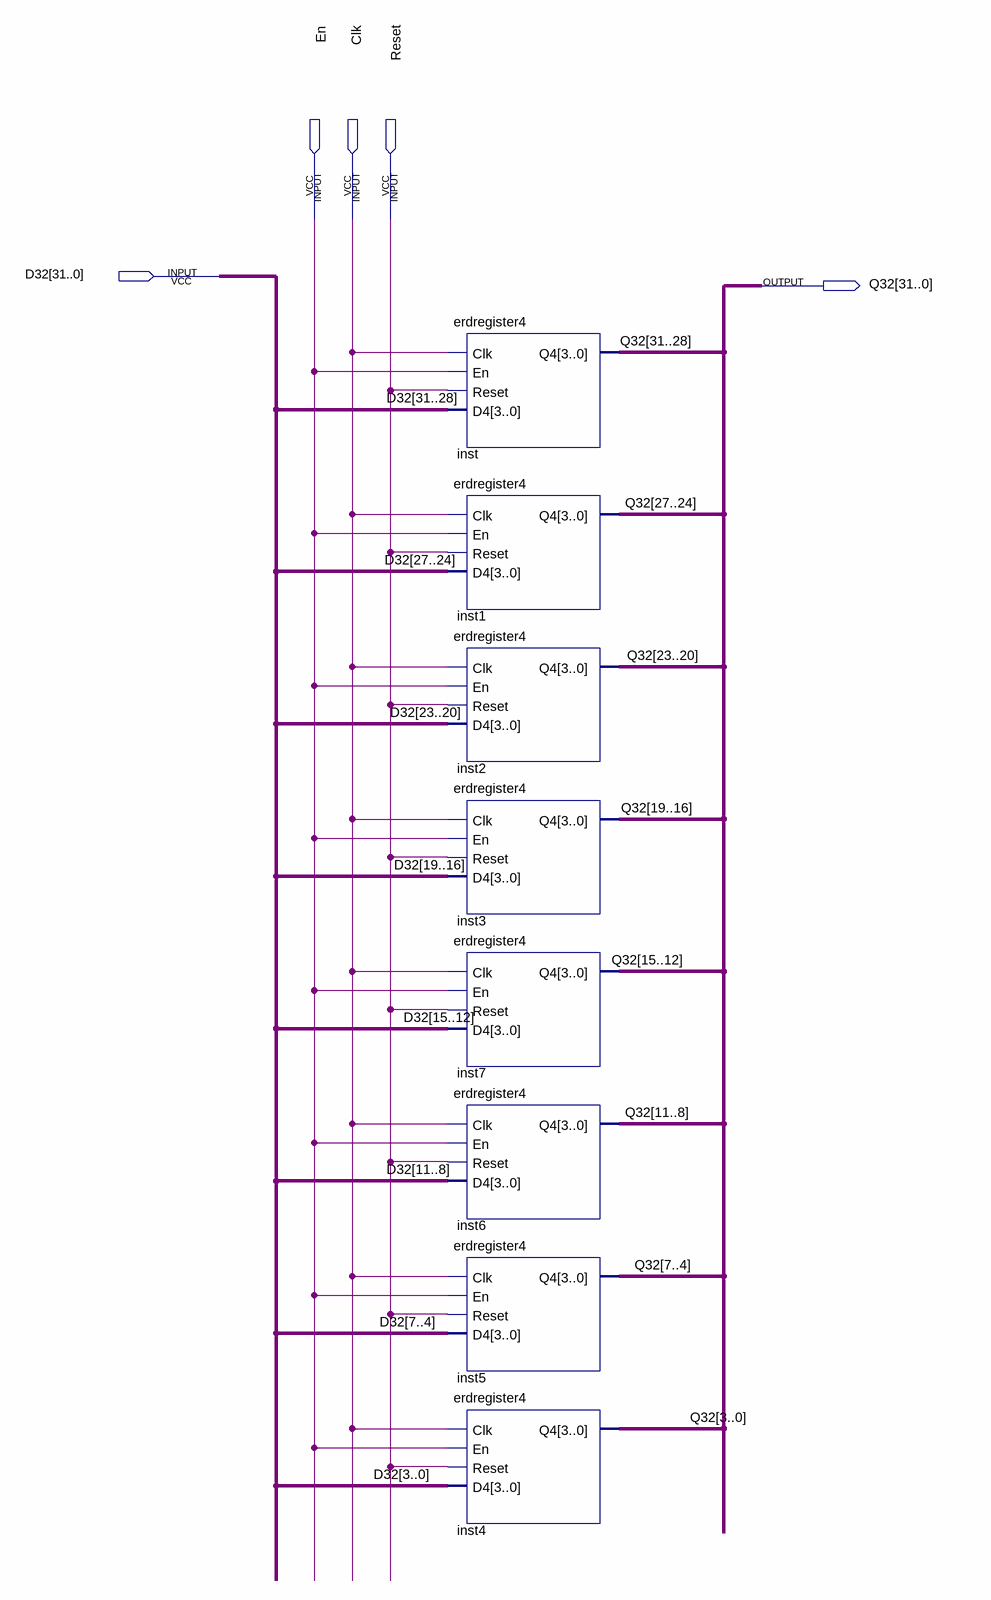
[diagram p0: schematic sheet]
// Quartus schematic erdregister32.bdf as structural Verilog: 8 symbols, 5 pins
module erdregister32 (
  input  En,
  input  Clk,
  input  Reset,
  input  [31:0] D32,
  output [31:0] Q32
);

  erdregister4 inst (.Clk(Clk), .En(En), .Reset(Reset), .D4(D32[31:28]), .Q4(Q32[31:28]));
  erdregister4 inst1 (.Clk(Clk), .En(En), .Reset(Reset), .D4(D32[27:24]), .Q4(Q32[27:24]));
  erdregister4 inst2 (.Clk(Clk), .En(En), .Reset(Reset), .D4(D32[23:20]), .Q4(Q32[23:20]));
  erdregister4 inst3 (.Clk(Clk), .En(En), .Reset(Reset), .D4(D32[19:16]), .Q4(Q32[19:16]));
  erdregister4 inst7 (.Clk(Clk), .En(En), .Reset(Reset), .D4(D32[15:12]), .Q4(Q32[15:12]));
  erdregister4 inst6 (.Clk(Clk), .En(En), .Reset(Reset), .D4(D32[11:8]), .Q4(Q32[11:8]));
  erdregister4 inst5 (.Clk(Clk), .En(En), .Reset(Reset), .D4(D32[7:4]), .Q4(Q32[7:4]));
  erdregister4 inst4 (.Clk(Clk), .En(En), .Reset(Reset), .D4(D32[3:0]), .Q4(Q32[3:0]));
endmodule
